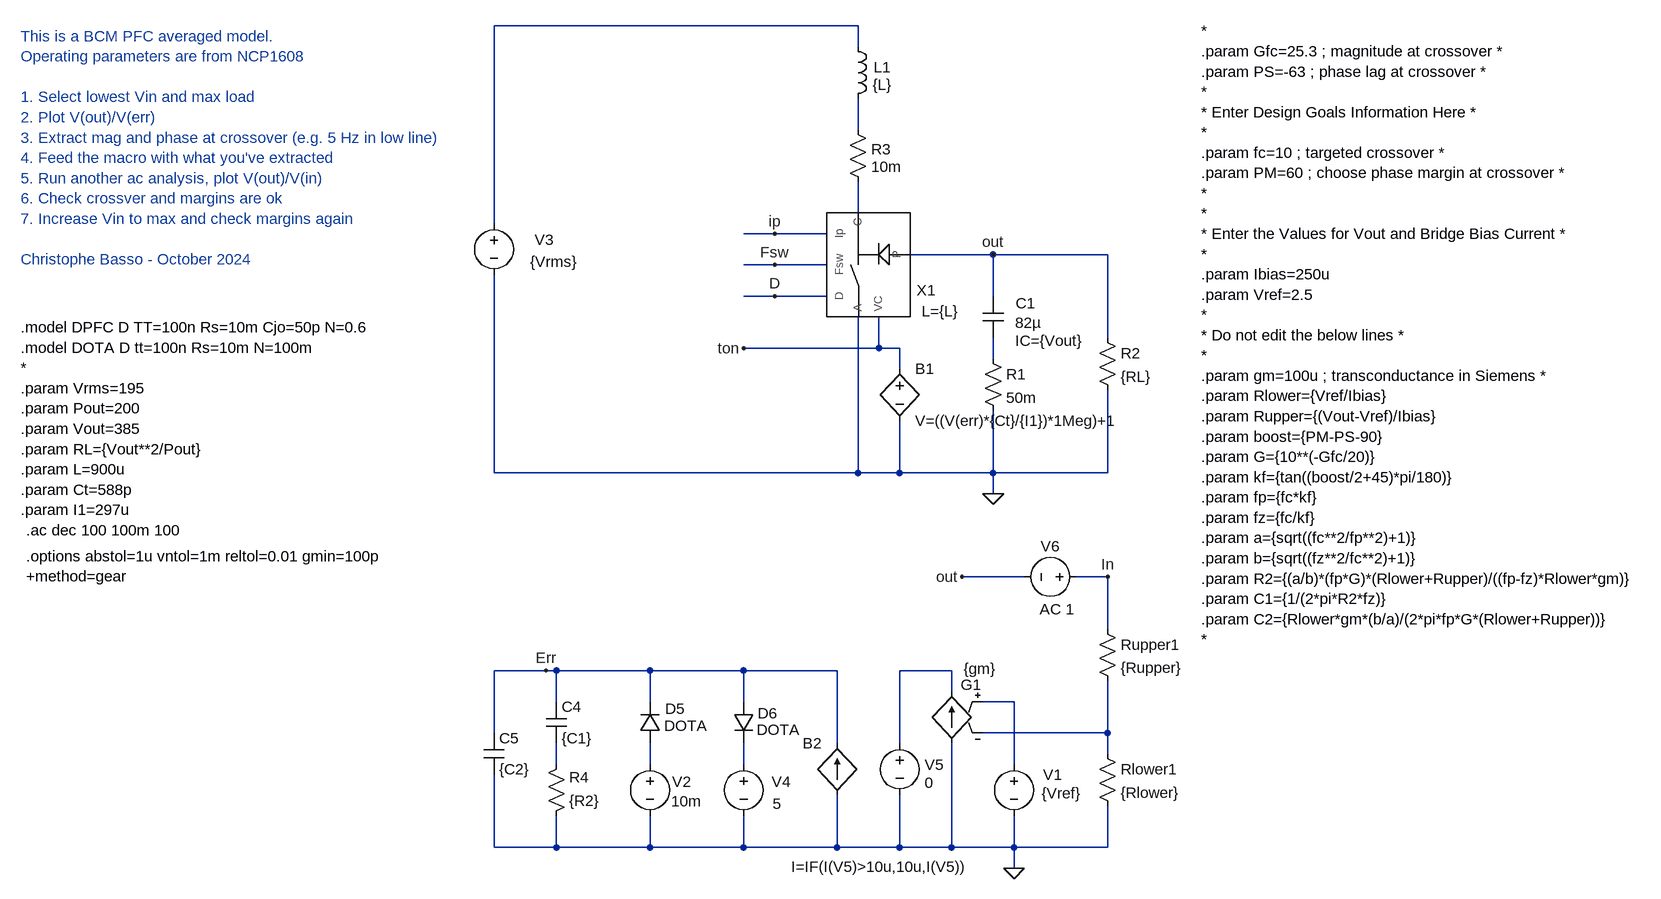
[diagram p0: schematic Boost BCM PFC - VM - avg - ac.asc]
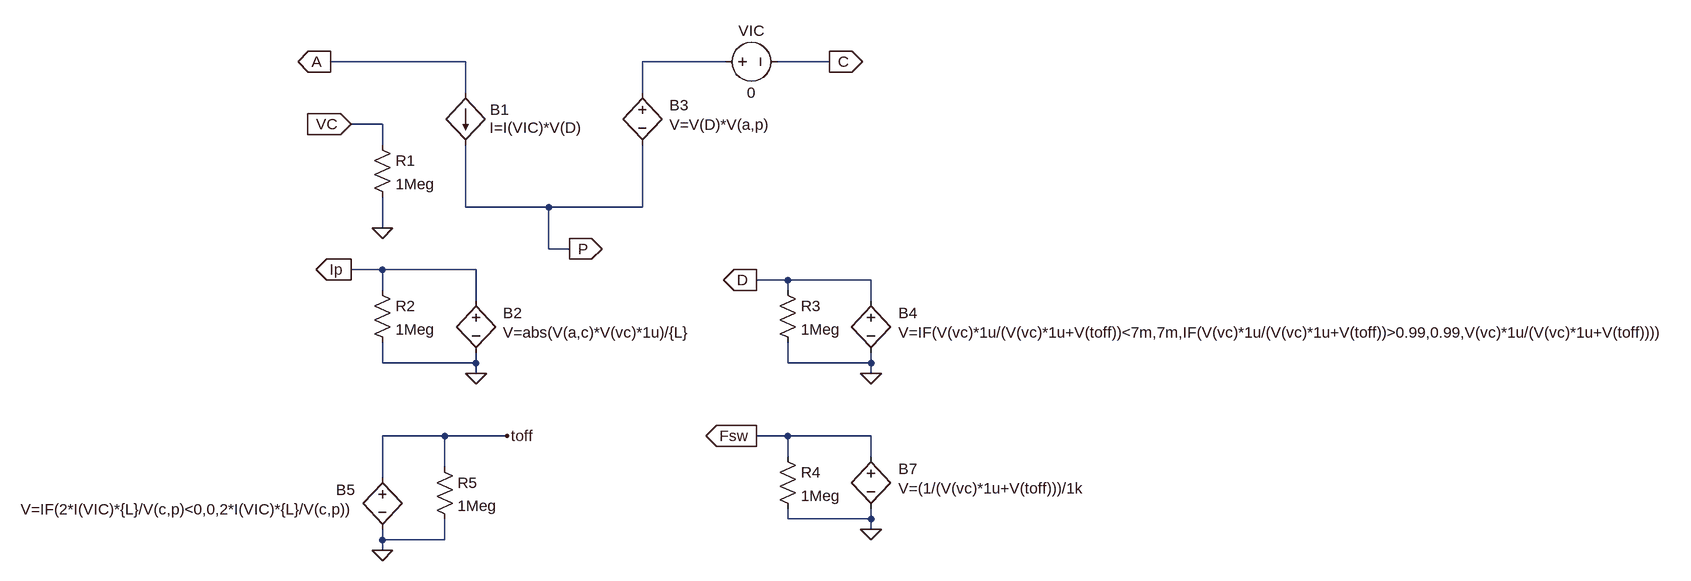
[diagram p1: sub-circuit pwmbcmvm.asc]
Boost BCM PFC - VM - avg - ac.asc, the LTspice schematic file:
Version 4.1
SHEET 1 2028 1156
WIRE 176 -192 -384 -192
WIRE 176 -160 176 -192
WIRE 176 -32 176 -80
WIRE 176 96 176 48
WIRE -384 112 -384 -192
WIRE 48 128 0 128
WIRE 128 128 48 128
WIRE 384 160 256 160
WIRE 560 160 384 160
WIRE 48 176 0 176
WIRE 128 176 48 176
WIRE 48 224 0 224
WIRE 128 224 48 224
WIRE 384 224 384 160
WIRE 560 288 560 160
WIRE 208 304 208 256
WIRE 208 304 0 304
WIRE 240 304 208 304
WIRE 384 320 384 288
WIRE 240 336 240 304
WIRE -384 496 -384 192
WIRE 176 496 176 256
WIRE 176 496 -384 496
WIRE 240 496 240 416
WIRE 240 496 176 496
WIRE 384 496 384 400
WIRE 384 496 240 496
WIRE 560 496 560 368
WIRE 560 496 384 496
WIRE 384 528 384 496
WIRE 432 656 336 656
WIRE 560 656 512 656
WIRE 560 736 560 656
WIRE -304 800 -384 800
WIRE -288 800 -304 800
WIRE -144 800 -288 800
WIRE 0 800 -144 800
WIRE 144 800 0 800
WIRE 320 800 240 800
WIRE 320 832 320 800
WIRE -288 848 -288 800
WIRE -144 848 -144 800
WIRE 0 848 0 800
WIRE 416 848 368 848
WIRE -384 896 -384 800
WIRE 560 896 560 816
WIRE 560 896 368 896
WIRE 144 912 144 800
WIRE 240 912 240 800
WIRE 560 928 560 896
WIRE -288 944 -288 912
WIRE -144 944 -144 912
WIRE 0 944 0 912
WIRE 416 944 416 848
WIRE -384 1072 -384 960
WIRE -288 1072 -288 1024
WIRE -288 1072 -384 1072
WIRE -144 1072 -144 1024
WIRE -144 1072 -288 1072
WIRE 0 1072 0 1024
WIRE 0 1072 -144 1072
WIRE 144 1072 144 992
WIRE 144 1072 0 1072
WIRE 240 1072 240 992
WIRE 240 1072 144 1072
WIRE 320 1072 320 912
WIRE 320 1072 240 1072
WIRE 416 1072 416 1024
WIRE 416 1072 320 1072
WIRE 560 1072 560 1008
WIRE 560 1072 416 1072
WIRE 416 1104 416 1072
FLAG 384 528 0
FLAG 384 160 out
FLAG 48 128 ip
FLAG 48 176 Fsw
FLAG 48 224 D
FLAG 416 1104 0
FLAG -304 800 Err
FLAG 336 656 out
FLAG 560 656 In
FLAG 0 304 ton
DATAFLAG 480 160 ""
DATAFLAG 0 128 ""
DATAFLAG 16 176 ""
DATAFLAG 16 224 ""
DATAFLAG 496 896 ""
DATAFLAG 16 304 ""
SYMBOL PWMBCMVM 192 192 R270
WINDOW 0 -7 89 VBottom 2
WINDOW 39 -40 111 VBottom 2
SYMATTR InstName X1
SYMATTR SpiceLine L={L}
SYMBOL cap 368 224 R0
WINDOW 0 51 11 Left 2
WINDOW 3 50 41 Left 2
WINDOW 123 50 69 Left 2
SYMATTR InstName C1
SYMATTR Value 82µ
SYMATTR Value2 IC={Vout}
SYMBOL res 368 304 R0
SYMATTR InstName R1
SYMATTR Value 50m
SYMBOL res 544 272 R0
SYMATTR InstName R2
SYMATTR Value {RL}
SYMBOL res 160 -48 R0
WINDOW 0 36 46 Left 2
WINDOW 3 36 73 Left 2
SYMATTR InstName R3
SYMATTR Value 10m
SYMBOL ind 160 -176 R0
WINDOW 0 40 48 Left 2
WINDOW 3 39 75 Left 2
SYMATTR InstName L1
SYMATTR Value {L}
SYMBOL res 544 912 R0
SYMATTR InstName Rlower1
SYMATTR Value {Rlower}
SYMBOL res 544 720 R0
SYMATTR InstName Rupper1
SYMATTR Value {Rupper}
SYMBOL voltage 416 928 R0
WINDOW 0 45 32 Left 2
WINDOW 3 43 61 Left 2
WINDOW 123 0 0 Left 0
WINDOW 39 0 0 Left 0
SYMATTR InstName V1
SYMATTR Value {Vref}
SYMBOL g 320 816 M0
WINDOW 0 -46 6 Left 2
WINDOW 3 -69 -19 Left 2
SYMATTR InstName G1
SYMATTR Value {gm}
SYMBOL diode -128 912 R180
WINDOW 0 -38 53 Left 2
WINDOW 3 -73 27 Left 2
SYMATTR InstName D5
SYMATTR Value DOTA
SYMBOL diode -16 848 R0
WINDOW 0 38 18 Left 2
WINDOW 3 36 43 Left 2
SYMATTR InstName D6
SYMATTR Value DOTA
SYMBOL voltage -144 928 R0
WINDOW 0 34 43 Left 2
WINDOW 3 33 73 Left 2
WINDOW 123 0 0 Left 0
WINDOW 39 0 0 Left 0
SYMATTR InstName V2
SYMATTR Value 10m
SYMBOL voltage 0 928 R0
WINDOW 0 43 43 Left 2
WINDOW 3 45 77 Left 2
SYMATTR InstName V4
SYMATTR Value 5
SYMBOL bv 240 320 R0
SYMATTR InstName B1
SYMATTR Value V=((V(err)*{Ct}/{I1})*1Meg)+1
SYMBOL voltage 240 896 R0
WINDOW 0 39 49 Left 2
WINDOW 3 39 77 Left 2
SYMATTR InstName V5
SYMATTR Value 0
SYMBOL bi 144 992 R180
WINDOW 0 24 80 Left 2
WINDOW 3 -202 -110 Left 2
SYMATTR InstName B2
SYMATTR Value I=IF(I(V5)>10u,10u,I(V5))
SYMBOL voltage 528 656 R90
WINDOW 0 -32 56 VBottom 2
WINDOW 3 32 56 VTop 2
WINDOW 123 34 46 VTop 2
WINDOW 39 0 0 Left 0
SYMATTR InstName V6
SYMATTR Value ""
SYMATTR Value2 AC 1
SYMBOL cap -304 912 M180
WINDOW 0 24 56 Left 2
WINDOW 3 24 8 Left 2
SYMATTR InstName C4
SYMATTR Value {C1}
SYMBOL res -304 1040 M180
WINDOW 0 36 76 Left 2
WINDOW 3 36 40 Left 2
SYMATTR InstName R4
SYMATTR Value {R2}
SYMBOL cap -400 960 M180
WINDOW 0 24 56 Left 2
WINDOW 3 24 8 Left 2
SYMATTR InstName C5
SYMATTR Value {C2}
SYMBOL voltage -384 96 R0
WINDOW 0 63 41 Left 2
WINDOW 3 56 75 Left 2
SYMATTR InstName V3
SYMATTR Value {Vrms}
TEXT -1112 272 Left 2 !.model DPFC D TT=100n Rs=10m Cjo=50p N=0.6\n.model DOTA D tt=100n Rs=10m N=100m\n*\n.param Vrms=195\n.param Pout=200\n.param Vout=385\n.param RL={Vout**2/Pout}\n.param L=900u\n.param Ct=588p\n.param I1=297u
TEXT -1104 624 Left 2 !.options abstol=1u vntol=1m reltol=0.01 gmin=100p\n+method=gear
TEXT -1104 584 Left 2 !.ac dec 100 100m 100
TEXT 704 -184 Left 2 !*\n.param Gfc=25.3 ; magnitude at crossover *\n.param PS=-63 ; phase lag at crossover *\n*\n* Enter Design Goals Information Here *\n*\n.param fc=10 ; targeted crossover *\n.param PM=60 ; choose phase margin at crossover *\n*\n*\n* Enter the Values for Vout and Bridge Bias Current *\n*\n.param Ibias=250u\n.param Vref=2.5\n*\n* Do not edit the below lines *\n*\n.param gm=100u ; transconductance in Siemens *\n.param Rlower={Vref/Ibias}\n.param Rupper={(Vout-Vref)/Ibias}\n.param boost={PM-PS-90}\n.param G={10**(-Gfc/20)}\n.param kf={tan((boost/2+45)*pi/180)}\n.param fp={fc*kf}\n.param fz={fc/kf}\n.param a={sqrt((fc**2/fp**2)+1)}\n.param b={sqrt((fz**2/fc**2)+1)}\n.param R2={(a/b)*(fp*G)*(Rlower+Rupper)/((fp-fz)*Rlower*gm)}\n.param C1={1/(2*pi*R2*fz)}\n.param C2={Rlower*gm*(b/a)/(2*pi*fp*G*(Rlower+Rupper))}\n*
TEXT -1112 -176 Left 2 ;This is a BCM PFC averaged model.\nOperating parameters are from NCP1608\n \n1. Select lowest Vin and max load\n2. Plot V(out)/V(err)\n3. Extract mag and phase at crossover (e.g. 5 Hz in low line)\n4. Feed the macro with what you've extracted\n5. Run another ac analysis, plot V(out)/V(in)\n6. Check crossver and margins are ok\n7. Increase Vin to max and check margins again\n \nChristophe Basso - October 2024

pwmbcmvm.asc, the sub-circuit schematic file:
Version 4
SHEET 1 2112 820
WIRE 64 48 -144 48
WIRE 464 48 336 48
WIRE 624 48 544 48
WIRE 64 96 64 48
WIRE 336 96 336 48
WIRE -64 144 -112 144
WIRE -64 176 -64 144
WIRE 64 272 64 176
WIRE 192 272 64 272
WIRE 336 272 336 176
WIRE 336 272 192 272
WIRE -64 304 -64 256
WIRE 192 336 192 272
WIRE 224 336 192 336
WIRE -64 368 -112 368
WIRE 80 368 -64 368
WIRE 560 384 512 384
WIRE 688 384 560 384
WIRE -64 400 -64 368
WIRE 560 400 560 384
WIRE 80 416 80 368
WIRE 688 416 688 384
WIRE -64 512 -64 480
WIRE 80 512 80 496
WIRE 80 512 -64 512
WIRE 560 512 560 480
WIRE 688 512 688 496
WIRE 688 512 560 512
WIRE 80 528 80 512
WIRE 688 528 688 512
WIRE 32 624 -64 624
WIRE 128 624 32 624
WIRE 560 624 512 624
WIRE 688 624 560 624
WIRE 560 656 560 624
WIRE 688 656 688 624
WIRE 32 672 32 624
WIRE -64 688 -64 624
WIRE 560 752 560 736
WIRE 688 752 688 736
WIRE 688 752 560 752
WIRE 688 768 688 752
WIRE -64 784 -64 768
WIRE 32 784 32 752
WIRE 32 784 -64 784
WIRE -64 800 -64 784
FLAG 80 528 0
FLAG -144 48 A
IOPIN -144 48 Out
FLAG 624 48 C
IOPIN 624 48 Out
FLAG 224 336 P
IOPIN 224 336 Out
FLAG -112 368 Ip
IOPIN -112 368 Out
FLAG 688 528 0
FLAG 512 384 D
IOPIN 512 384 Out
FLAG -64 800 0
FLAG 128 624 toff
FLAG 512 624 Fsw
IOPIN 512 624 Out
FLAG 688 768 0
FLAG -64 304 0
FLAG -112 144 VC
IOPIN -112 144 In
SYMBOL bi 64 96 R0
WINDOW 0 38 26 Left 2
WINDOW 3 37 53 Left 2
SYMATTR InstName B1
SYMATTR Value I=I(VIC)*V(D)
SYMBOL bv 80 400 R0
WINDOW 0 42 35 Left 2
WINDOW 3 42 65 Left 2
SYMATTR InstName B2
SYMATTR Value V=abs(V(a,c)*V(vc)*1u)/{L}
SYMBOL voltage 448 48 R270
WINDOW 0 32 56 VTop 2
WINDOW 3 -32 56 VBottom 2
WINDOW 123 0 0 Left 0
WINDOW 39 0 0 Left 0
SYMATTR InstName VIC
SYMATTR Value 0
SYMBOL bv 688 400 R0
WINDOW 0 42 35 Left 2
WINDOW 3 42 65 Left 2
SYMATTR InstName B4
SYMATTR Value V=IF(V(vc)*1u/(V(vc)*1u+V(toff))<7m,7m,IF(V(vc)*1u/(V(vc)*1u+V(toff))>0.99,0.99,V(vc)*1u/(V(vc)*1u+V(toff))))
SYMBOL bv -64 672 M0
WINDOW 0 42 35 Left 2
WINDOW 3 42 65 Left 2
SYMATTR InstName B5
SYMATTR Value V=IF(2*I(VIC)*{L}/V(c,p)<0,0,2*I(VIC)*{L}/V(c,p))
SYMBOL bv 688 640 R0
WINDOW 0 42 35 Left 2
WINDOW 3 42 65 Left 2
SYMATTR InstName B7
SYMATTR Value V=(1/(V(vc)*1u+V(toff)))/1k
SYMBOL bv 336 80 R0
WINDOW 0 42 35 Left 2
WINDOW 3 42 65 Left 2
SYMATTR InstName B3
SYMATTR Value V=V(D)*V(a,p)
SYMBOL res -80 160 R0
SYMATTR InstName R1
SYMATTR Value 1Meg
SYMBOL res -80 384 R0
SYMATTR InstName R2
SYMATTR Value 1Meg
SYMBOL res 544 384 R0
SYMATTR InstName R3
SYMATTR Value 1Meg
SYMBOL res 544 640 R0
SYMATTR InstName R4
SYMATTR Value 1Meg
SYMBOL res 16 656 R0
SYMATTR InstName R5
SYMATTR Value 1Meg

The netlist it stands for:
* Boost BCM PFC - VM - avg - ac.asc
X§X1 ton 0 N003 out ip Fsw D pwmbcmvm params: L={L}
C1 out N004 82µ IC={Vout}
R1 N004 0 50m
R2 out 0 {RL}
R3 N002 N003 10m
L1 N001 N002 {L}
Rlower1 N007 0 {Rlower}
Rupper1 In N007 {Rupper}
V1 N006 0 {Vref}
G1 0 N005 N006 N007 {gm}
D5 N009 Err DOTA
D6 Err N010 DOTA
V2 N009 0 10m
V4 N010 0 5
B1 ton 0 V=((V(err)*{Ct}/{I1})*1Meg)+1
V5 N005 0 0
B2 0 Err I=IF(I(V5)>10u,10u,I(V5))
V6 In out AC 1
C4 N008 Err {C1}
R4 0 N008 {R2}
C5 0 Err {C2}
V3 N001 0 {Vrms}

* block symbol definitions
.subckt pwmbcmvm VC A C P Ip Fsw D
B1 A P I=I(VIC)*V(D)
B2 Ip 0 V=abs(V(a,c)*V(vc)*1u)/{L}
VIC N001 C 0
B4 D 0 V=IF(V(vc)*1u/(V(vc)*1u+V(toff))<7m,7m,IF(V(vc)*1u/(V(vc)*1u+V(toff))>0.99,0.99,V(vc)*1u/(V(vc)*1u+V(toff))))
B5 toff 0 V=IF(2*I(VIC)*{L}/V(c,p)<0,0,2*I(VIC)*{L}/V(c,p))
B7 Fsw 0 V=(1/(V(vc)*1u+V(toff)))/1k
B3 N001 P V=V(D)*V(a,p)
R1 VC 0 1Meg
R2 Ip 0 1Meg
R3 D 0 1Meg
R4 Fsw 0 1Meg
R5 toff 0 1Meg
.ends pwmbcmvm

.model D D
.lib standard.dio
.model DPFC D TT=100n Rs=10m Cjo=50p N=0.6
.model DOTA D tt=100n Rs=10m N=100m
*
.param Vrms=195
.param Pout=200
.param Vout=385
.param RL={Vout**2/Pout}
.param L=900u
.param Ct=588p
.param I1=297u
.options abstol=1u vntol=1m reltol=0.01 gmin=100p
+method=gear
.ac dec 100 100m 100
*
.param Gfc=25.3 ; magnitude at crossover *
.param PS=-63 ; phase lag at crossover *
*
* Enter Design Goals Information Here *
*
.param fc=10 ; targeted crossover *
.param PM=60 ; choose phase margin at crossover *
*
*
* Enter the Values for Vout and Bridge Bias Current *
*
.param Ibias=250u
.param Vref=2.5
*
* Do not edit the below lines *
*
.param gm=100u ; transconductance in Siemens *
.param Rlower={Vref/Ibias}
.param Rupper={(Vout-Vref)/Ibias}
.param boost={PM-PS-90}
.param G={10**(-Gfc/20)}
.param kf={tan((boost/2+45)*pi/180)}
.param fp={fc*kf}
.param fz={fc/kf}
.param a={sqrt((fc**2/fp**2)+1)}
.param b={sqrt((fz**2/fc**2)+1)}
.param R2={(a/b)*(fp*G)*(Rlower+Rupper)/((fp-fz)*Rlower*gm)}
.param C1={1/(2*pi*R2*fz)}
.param C2={Rlower*gm*(b/a)/(2*pi*fp*G*(Rlower+Rupper))}
*
* This is a BCM PFC averaged model.
* Operating parameters are from NCP1608
* 1. Select lowest Vin and max load
* 2. Plot V(out)/V(err)
* 3. Extract mag and phase at crossover (e.g. 5 Hz in low line)
* 4. Feed the macro with what you've extracted
* 5. Run another ac analysis, plot V(out)/V(in)
* 6. Check crossver and margins are ok
* 7. Increase Vin to max and check margins again
* Christophe Basso - October 2024
.backanno
.end